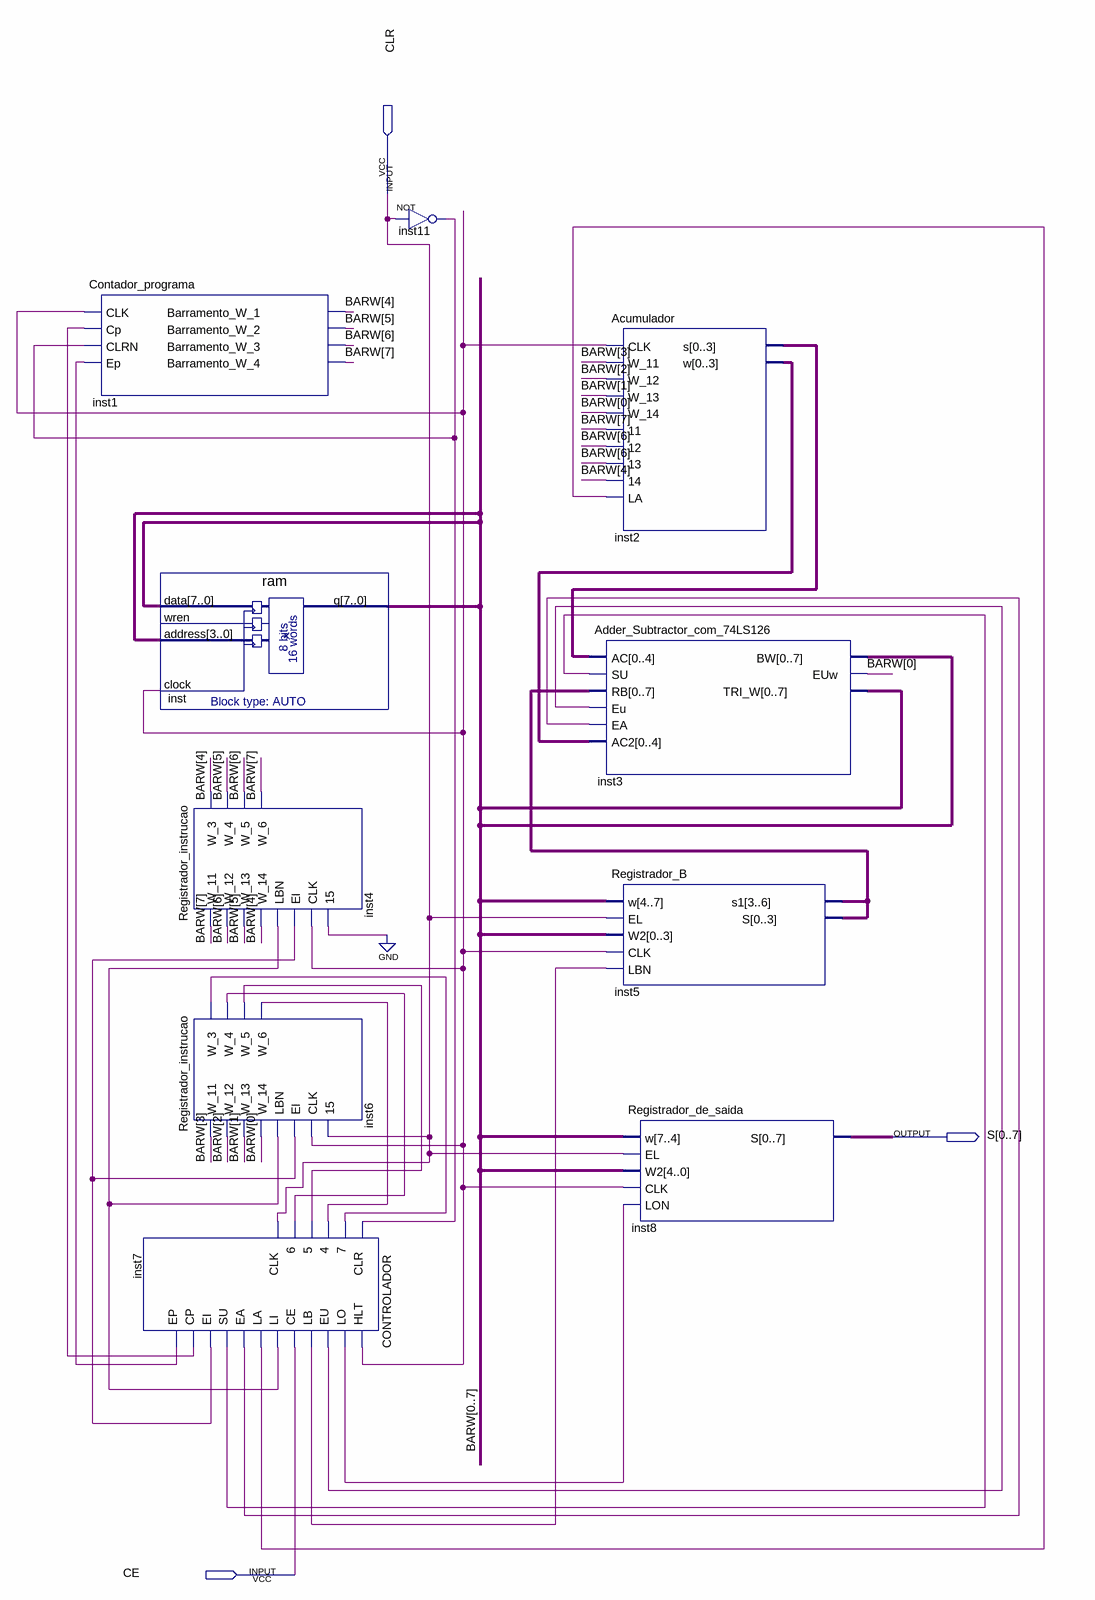
[diagram p0: schematic sheet]
// Quartus schematic Microprocessador_uP.bdf as structural Verilog: 10 symbols, 3 pins
module Microprocessador_uP (
  input  CLR,
  input  CE,
  output [0:7] S
);

  wire inst6_w_3, inst6_w_4, inst6_w_5, inst6_w_6, inst7_cp, inst7_ea, inst7_ei, inst7_ep, inst7_eu,
       inst7_hlt, inst7_la, inst7_lb, inst7_li, inst7_lo, inst7_su, inst11_out;
  wire [4:0] inst2_s, inst2_w;
  wire [7:0] BARW, inst5_s1;

  Contador_programa inst1 (
    .CLK(inst7_hlt), .Cp(inst7_cp), .CLRN(inst11_out), .Ep(inst7_ep), .Barramento_W_1(BARW[4]),
    .Barramento_W_2(BARW[5]), .Barramento_W_3(BARW[6]), .Barramento_W_4(BARW[7]));
  ram inst (
    .data({BARW[0], BARW[1], BARW[2], BARW[3], BARW[4], BARW[5], BARW[6], BARW[7]}),
    .address({BARW[0], BARW[1], BARW[2], BARW[3], BARW[4], BARW[5], BARW[6], BARW[7]}), .clock(inst7_hlt),
    .q({BARW[0], BARW[1], BARW[2], BARW[3], BARW[4], BARW[5], BARW[6], BARW[7]}));  // open: wren
  CONTROLADOR inst7 (
    .CLR(inst11_out), .\7 (inst6_w_3), .\4 (inst6_w_6), .\5 (inst6_w_5), .\6 (inst6_w_4), .CLK(CLR),
    .HLT(inst7_hlt), .LO(inst7_lo), .EU(inst7_eu), .LB(inst7_lb), .CE(CE), .LI(inst7_li), .LA(inst7_la),
    .EA(inst7_ea), .SU(inst7_su), .EI(inst7_ei), .CP(inst7_cp), .EP(inst7_ep));
  Registrador_instrucao inst4 (
    .W_11(BARW[7]), .W_12(BARW[6]), .W_13(BARW[5]), .W_14(BARW[4]), .LBN(inst7_li), .El(inst7_ei),
    .CLK(inst7_hlt), .\15 (1'b0), .W_3(BARW[4]), .W_4(BARW[5]), .W_5(BARW[6]), .W_6(BARW[7]));
  Registrador_instrucao inst6 (
    .W_11(BARW[3]), .W_12(BARW[2]), .W_13(BARW[1]), .W_14(BARW[0]), .LBN(inst7_li), .El(inst7_ei),
    .CLK(inst7_hlt), .\15 (CLR), .W_3(inst6_w_3), .W_4(inst6_w_4), .W_5(inst6_w_5), .W_6(inst6_w_6));
  not inst11 (inst11_out, CLR);
  Acumulador inst2 (
    .CLK(inst7_hlt), .W_11(BARW[3]), .W_12(BARW[2]), .W_13(BARW[1]), .W_14(BARW[0]), .\11 (BARW[7]),
    .\12 (BARW[6]), .\13 (BARW[6]), .\14 (BARW[4]), .LA(inst7_la), .s(inst2_s), .w(inst2_w));
  Adder_Subtractor_com_74LS126 inst3 (
    .AC(inst2_s), .SU(inst7_su), .RB(inst5_s1), .Eu(inst7_eu), .EA(inst7_ea), .AC2(inst2_w),
    .BW({BARW[0], BARW[1], BARW[2], BARW[3], BARW[4], BARW[5], BARW[6], BARW[7]}), .EUw(BARW[0]),
    .TRI_W({BARW[0], BARW[1], BARW[2], BARW[3], BARW[4], BARW[5], BARW[6], BARW[7]}));
  Registrador_B inst5 (
    .w({BARW[0], BARW[1], BARW[2], BARW[3], BARW[4], BARW[5], BARW[6], BARW[7]}), .EL(CLR),
    .W2({BARW[0], BARW[1], BARW[2], BARW[3], BARW[4], BARW[5], BARW[6], BARW[7]}), .CLK(inst7_hlt),
    .LBN(inst7_lb), .s1(inst5_s1), .S(inst5_s1));
  Registrador_de_saida inst8 (
    .w({BARW[0], BARW[1], BARW[2], BARW[3], BARW[4], BARW[5], BARW[6], BARW[7]}), .EL(CLR),
    .W2({BARW[0], BARW[1], BARW[2], BARW[3], BARW[4], BARW[5], BARW[6], BARW[7]}), .CLK(inst7_hlt),
    .LON(inst7_lo), .S(S));
endmodule
